# EAGLE design MCP73871_Solar (EAGLE 5.01)
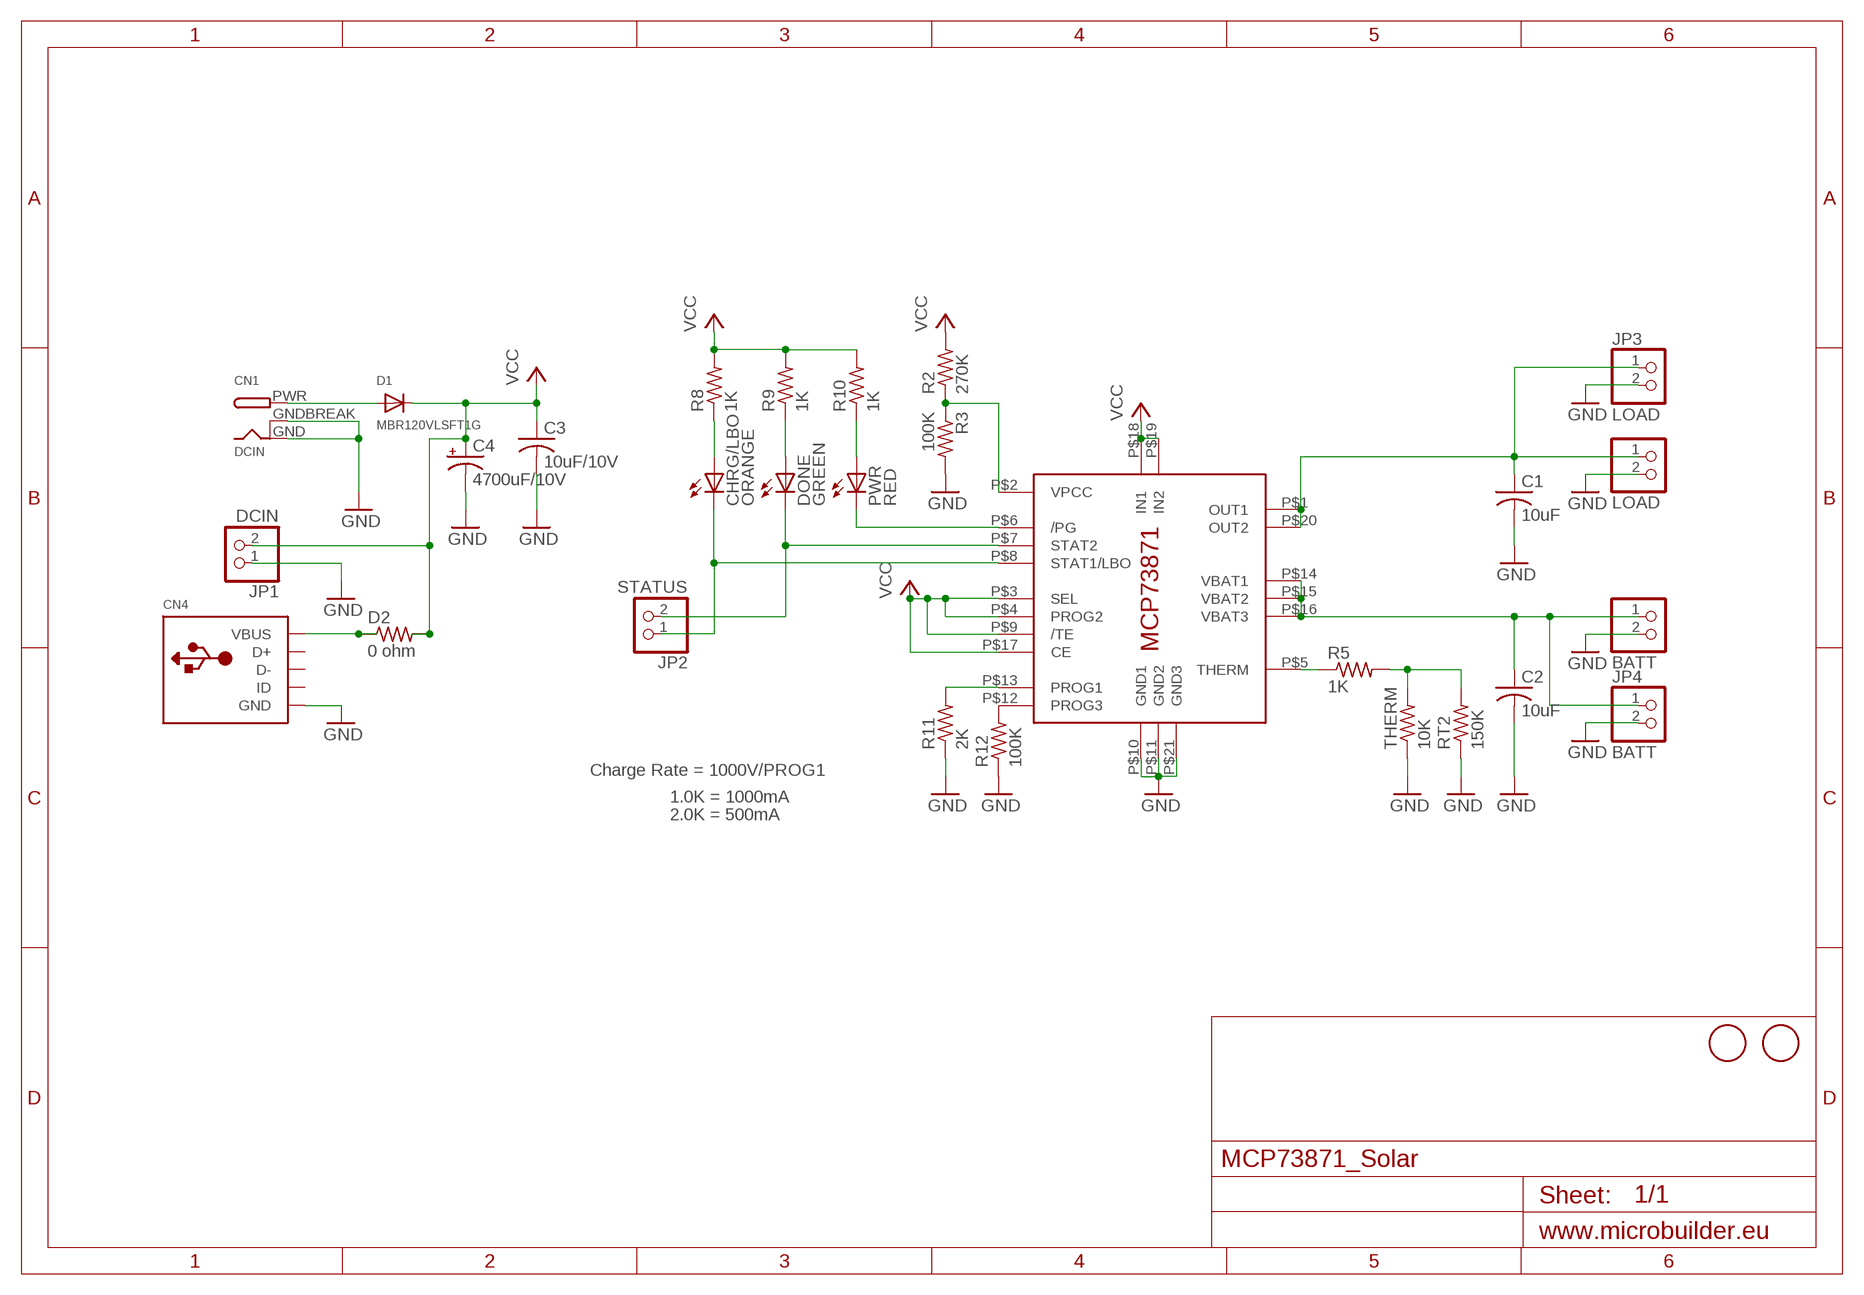
[diagram p0: schematic, sheet 1]

## Parts
BATT  JST_2PIN-SMT-RA  [JST-PH-2-SMT-RA]
C1  10uF  C-USC0805K  [C0805K]
C2  10uF  C-USC0805K  [C0805K]
C3  10uF/10V  C-USC0805K  [C0805K]
C4  4700uF/10V  CPOL-USE5-13  [E5-13]
CHRG/LBO  ORANGE  LEDCHIP-LED0805  [CHIP-LED0805]
CN1  DCIN  DCBARREL1.3MM  [DCJACK_1.3MM_PTH]
CN4  USBMINIB  [USB-MINIB]
D1  MBR120VLSFT1G  DIODESOD-123  [SOD-123]
D2  0 ohm  R-US_R0805  [R0805]
DONE  GREEN  LEDCHIP-LED0805  [CHIP-LED0805]
IC1  MCP73871  [QFN20_4MM]
JP1  DCIN  HEADER-1X2  [1X02_OVAL]
JP2  STATUS  HEADER-1X2  [1X02_OVAL]
JP3  LOAD  HEADER-1X2  [1X02_OVAL]
JP4  BATT  HEADER-1X2  [1X02_OVAL]
LOAD  JST_2PIN-SMT-RA  [JST-PH-2-SMT-RA]
PWR  RED  LEDCHIP-LED0805  [CHIP-LED0805]
R2  270K  R-US_R0805  [R0805]
R3  100K  R-US_R0805  [R0805]
R5  1K  R-US_M0805  [M0805]
R8  1K  R-US_R0805  [R0805]
R9  1K  R-US_R0805  [R0805]
R10  1K  R-US_R0805  [R0805]
R11  2K  R-US_FLIPFLOP  [0805-THM]
R12  100K  R-US_R0805  [R0805]
RT2  150K  R-US_M0805  [M0805]
THERM  10K  R-US_FLIPFLOP  [0805-THM]
U$2  FIDUCIAL  [FIDUCIAL_1MM]
U$3  FIDUCIAL  [FIDUCIAL_1MM]

## Nets
BATT: BATT.1 C2.1 IC1.P$14(VBAT1) IC1.P$15(VBAT2) IC1.P$16(VBAT3) JP4.1
GND: BATT.2 C1.2 C2.2 C3.2 C4.- CN1.GND CN1.GNDBREAK CN4.GND IC1.P$10(GND1) IC1.P$11(GND2) IC1.P$21(GND3) JP1.1 JP3.2 JP4.2 LOAD.2 R3.2 R11.1 R12.1 RT2.1 THERM.1
N$1: IC1.P$6(/PG) PWR.C
N$2: CN4.VBUS D2.1
N$4: DONE.C IC1.P$7(STAT2) JP2.2
N$5: IC1.P$5(THERM) R5.1
N$6: IC1.P$2(VPCC) R2.1 R3.1
N$7: C1.1 IC1.P$1(OUT1) IC1.P$20(OUT2) JP3.1 LOAD.1
N$8: R5.2 RT2.2 THERM.2
N$10: CN1.PWR D1.A
N$11: CHRG/LBO.C IC1.P$8(STAT1/LBO) JP2.1
N$12: CHRG/LBO.A R8.1
N$13: DONE.A R9.1
N$14: PWR.A R10.1
N$15: IC1.P$12(PROG3) R12.2
N$16: IC1.P$13(PROG1) R11.2
VCC: C3.1 C4.+ D1.C D2.2 IC1.P$3(SEL) IC1.P$4(PROG2) IC1.P$9(/TE) IC1.P$17(CE) IC1.P$18(IN1) IC1.P$19(IN2) JP1.2 R2.2 R8.2 R9.2 R10.2
Unconnected: CN4.D+ CN4.D- CN4.ID

## Notes on the sheet
- Charge Rate = 1000V/PROG1
- 1.0K = 1000mA
- 2.0K = 500mA

## Library data of the parts
BATT LOAD = adafruit:JST_2PIN: JST 2-Pin Connectors of various flavors SMT-RA (S2B-PH-SM4) 4UConnector #17311 SMT (B2B-PH-SM4) THM-RA (S2B-PH) THM (B2B-PH)
C1-C3 = adafruit:C-US: CAPACITOR, American symbol
C4 = adafruit:CPOL-US: POLARIZED CAPACITOR, American symbol
CHRG/LBO DONE PWR = adafruit:LED: LED OSRAM: - CHIPLED LG R971, LG N971, LY N971, LG Q971, LY Q971, LO R971, LY R971 LH N974, LH R974 LS Q976, LO Q976, LY Q976 LO Q996 - Hyper CHIPLED LW Q18S LB Q993, LB Q99A, LB R99A - SideLED LS A670, LO A670, LY A670, LG A670, LP A670 LB A673, LV A673, LT A673, LW A673 LH A674 LY A675 LS A676, LA A676, LO A676, LY A676, LW A676 LS A679, LY A679, LG A679 - Hyper Micro SIDELED® LS Y876, LA Y876, LO Y876, LY Y876 LT Y87S - SmartLED LW L88C, LW L88S LB L89C, LB L89S, LG L890 LS L89K, LO L89K, LY L89K LS L896, LA L896, LO L896, LY L896 - TOPLED LS T670, LO T670, LY T670, LG T670, LP T670 LSG T670, LSP T670, LSY T670, LOP T670, LYG T670 LG T671, LOG T671, LSG T671 LB T673, LV T673, LT T673, LW T673 LH T674 LS T676, LA T676, LO T676, LY T676, LB T676, LH T676, LSB T676, LW T676 LB T67C, LV T67C, LT T67C, LS T67K, LO T67K, LY T67K, LW E67C LS E67B, LA E67B, LO E67B, LY E67B, LB E67C, LV E67C, LT E67C LW T67C LS T679, LY T679, LG T679 LS T770, LO T770, LY T770, LG T770, LP T770 LB T773, LV T773, LT T773, LW T773 LH T774 LS E675, LA E675, LY E675, LS T675 LS T776, LA T776, LO T776, LY T776, LB T776 LHGB T686 LT T68C, LB T68C - Hyper Mini TOPLED® LB M676 - Mini TOPLED Santana® LG M470 LS M47K, LO M47K, LY M47K Source: http://www.osram.convergy.de/
CN1 = microbuilder:DCBARREL: DC Barrel Jack DCJACK_1.3MM_PTH - Through Hole 1.3mm Jack (4UConnector: 05536) DCJACK_2MM_PTH - Through Hole 2.0/2.1 Jack (4UConnector: 05537) DCJACK_2MM_SMT - SMT 2.0/2.1mm Jack(4UConnector: 03267)
CN4 = adafruit:USB: USB Connectors USBMINIB - Surface Mount Female Mini-B USB Connector 4UConnector: 06564 By microbuilder.eu Thru-hole RA Female Mini-B USB Connector 4UConnector: 18732 By ladyada.net
D1 = microbuilder:DIODE: Diode SMADIODE - SMA Surface Mount Package 20V 1A Schottky Diode Digikey (500mV @ 1A, 500uA Vr @ 20V): 641-1014-6-ND SOD-123 30V 500mA (430mV Vf, 130uA Vr @ 30V) Schottky Diode - Digikey: B0530W-FDICT-ND SOD-323 10V 570mA (380mV Vf, 3ns) Schottky Diode - Digikey: ZLLS410CT-ND 1N4148WS - 75V 150mA (1V Vf @ 10mA, 4ns) Simple Diode - Digikey: 1N4148WSFSCT-ND, Mouser: 512-1N4148WS SOD-523 30V 30mA Schottky Diode (RB751S-40TE61) - Digikey: RB751S-40TE61CT-ND SOT23-R/W - SOT23 Package (R = Solder Paste/Reflow Ovens, W = Hand-Soldering) BAT54Film 40V 300mA - Digikey: 497-7162-1-ND DO-1N4148 Through Hole Small Current Diode (any model)
D2 R2 R3 R5 R8-R12 RT2 THERM = adafruit:R-US_: RESISTOR, American symbol
IC1 = adafruit:MCP73871
JP1-JP4 = microbuilder:HEADER-1X2: PIN HEADER
U$2 U$3 = adafruit:FIDUCIAL: For use by pick and place machines to calibrate the vision/machine, 1mm By microbuilder.eu

## Board
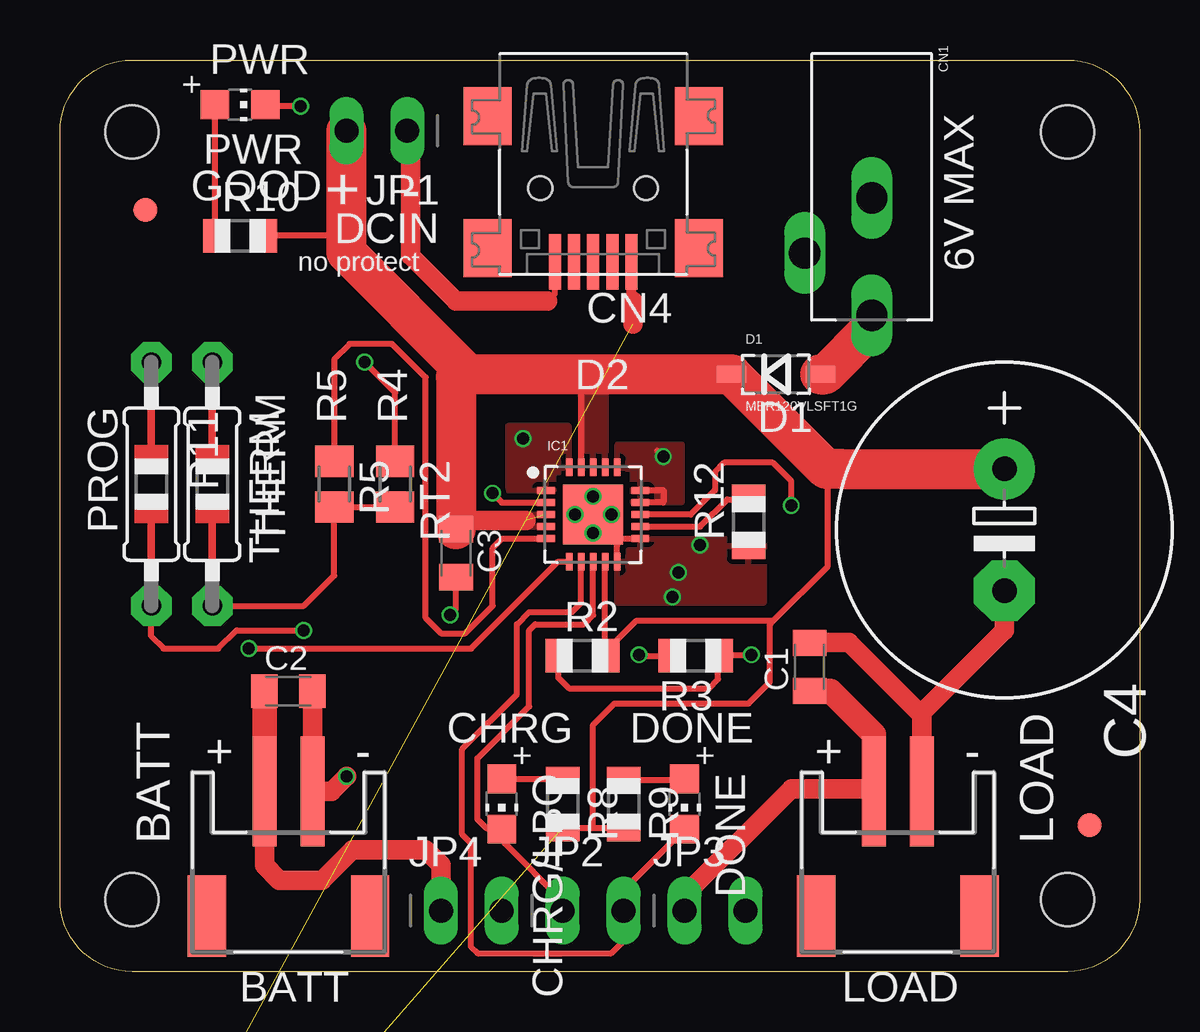
[diagram p1: board, top side]
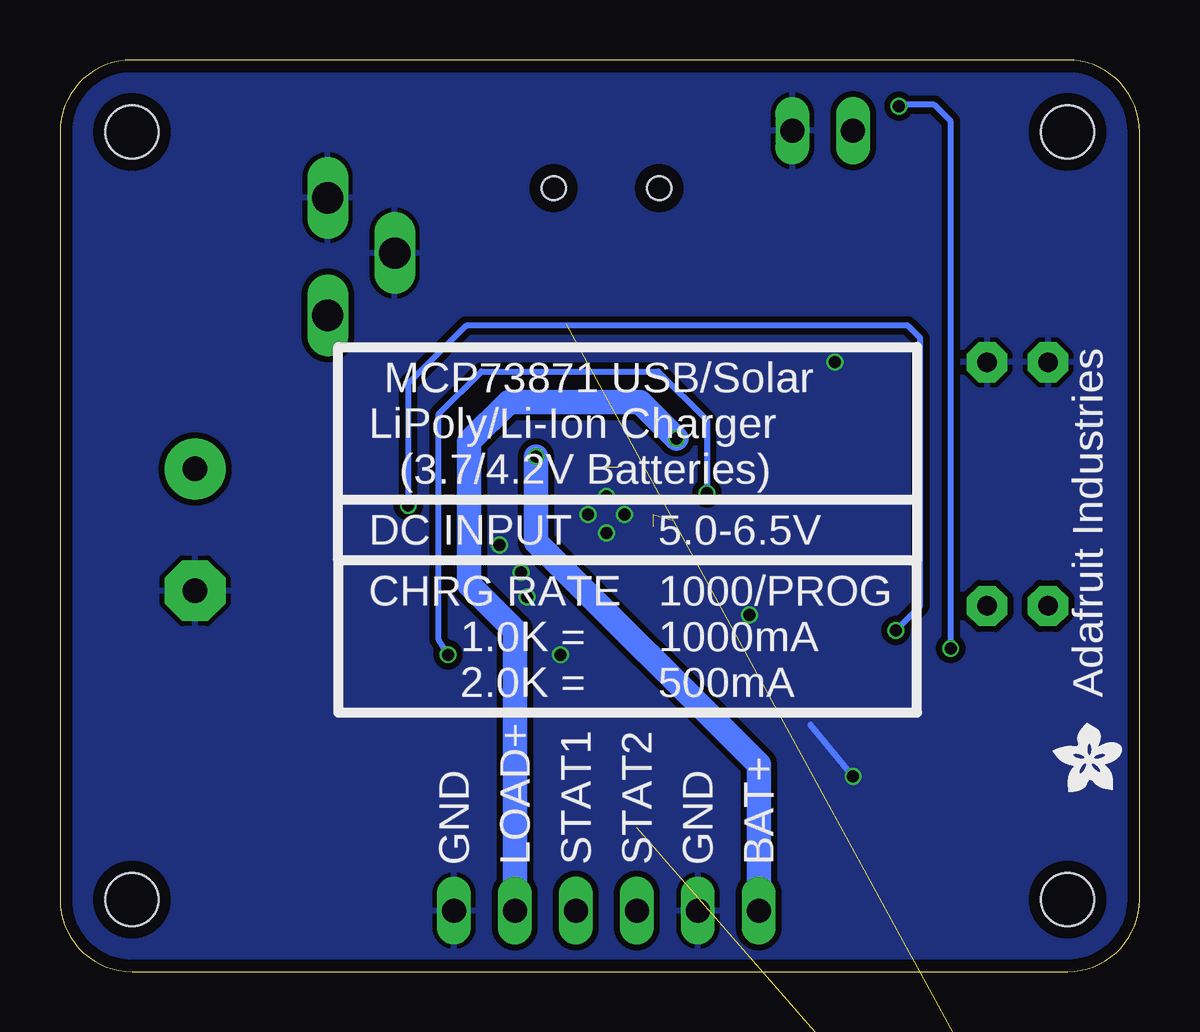
[diagram p2: board, bottom side, seen from below]

Size 45 x 38 mm. Coordinates in mm from the lower left corner, seen from the top.
Outline: 0,3 0,35 arc-90 3,38 42,38 arc-90 45,35 45,3 arc-90 42,0 3,0 arc-90 0,3
Copper layers (1*16): Top 0.035mm / dielectric 1.5mm / Bottom 0.035mm
Design rules "PCBCart-.1mmAnnulars": minimum track width 8mil, minimum drill 0.4mm, track to track 8mil, track to pad 8mil, pad to pad 8mil, via to via 8mil, smd to smd 8mil, copper to edge 20mil, drill to drill 8mil, minimum pad ring 8mil, minimum via ring 4mil, stop-mask expansion 3mil, vias tented up to drill 20mil, thermal gap 8mil
Holes 2.2 mm at 3,35 3,3 42,3 42,35
tRestrict: area 20.1,18.7 to 20.4,18.9; 9 lines

### Footprints (pad centres in the part's own frame; a part is rotated, then mirrored left to right if it is on the bottom)
JST-PH-2-SMT-RA = smd 1 x 4.6: 1 1,-3.7; 2 -1,-3.7 | smd 1.6 x 3.4: NC1 -3.4,1.5; NC2 3.4,1.5
C0805K = smd 1.1 x 1.4: 1 -1,0; 2 1,0
E5-13 = drill 1.016 pad 2.54 round: + -2.54,0 | drill 1.016 pad 2.54 octagon: - 2.54,0
CHIP-LED0805 = smd 1.2 x 1.2: A 0,-1.05; C 0,1.05
DCJACK_1.3MM_PTH = drill 1.3 long: GND 0,6; GNDBREAK 2.8,8.3; PWR 0,10.9
USB-MINIB = smd 0.5 x 2.308: D+ 0,4.064; D- -0.8,4.064; GND 1.6,4.064; ID 0.8,4.064; VBUS -1.6,4.064 | smd 2 x 2.4: GND1 -4.4,-2; GND2 -4.4,3.5; GND3 4.4,3.5; GND4 4.4,-2 | hole 1: -2.2,1; 2.2,1
SOD-123 = smd 1.2 x 0.7: A 1.85,0; C -1.85,0
R0805 = smd 1.1 x 1.4: 1 -1,0; 2 1,0
QFN20_4MM = smd 0.73 x 0.28: P$1 -1.965,1; P$2 -1.965,0.5; P$3 -1.965,0; P$4 -1.965,-0.5; P$5 -1.965,-1; P$11 1.965,-1; P$12 1.965,-0.5; P$13 1.965,0; P$14 1.965,0.5; P$15 1.965,1 | smd 0.28 x 0.73: P$6 -1,-1.965; P$7 -0.5,-1.965; P$8 0,-1.965; P$9 0.5,-1.965; P$10 1,-1.965; P$16 1,1.965; P$17 0.5,1.965; P$18 0,1.965; P$19 -0.5,1.965; P$20 -1,1.965 | smd 2.5 x 2.5: P$21 0,0
1X02_OVAL = drill 1 long: 1 -1.27,0; 2 1.27,0
M0805 = smd 1.3 x 1.6: 1 -0.95,0; 2 0.95,0
0805-THM = drill 0.813 pad 1.676 octagon: 1 -5.08,0; 2 5.08,0
FIDUCIAL_1MM = smd 1 x 1: 1 0,0

### Placement (x,y rotation side)
BATT  9.53,3.81 180 top
C1  31.24,12.7 90 top
C2  9.53,11.68 0 top
C3  16.51,17.43 270 top
C4  39.37,18.41 270 top
CHRG/LBO  18.41,6.99 180 top
CN1  33.84,38.25 180 top
CN4  22.23,33.66 180 top
D1  29.84,24.89 0 top
D2  2.54,-13.97 0 top  (outside the outline)
DONE  26.04,6.99 180 top
IC1  22.23,19.05 0 top
JP1  13.21,35.05 180 top
JP2  22.23,2.54 0 top
JP3  27.3,2.54 0 top
JP4  17.14,2.54 0 top
LOAD  34.92,3.81 180 top
PWR  7.51,36.13 270 top
R2  21.78,13.16 0 top
R3  26.5,13.16 180 top
R5  11.43,20.32 270 top
R8  20.95,6.99 270 top
R9  23.5,6.99 270 top
R10  7.51,30.67 0 top
R11  3.81,20.32 270 top
R12  28.7,18.75 90 top
RT2  13.97,20.32 270 top
THERM  6.35,20.32 270 top
U$1  [ADAFRUIT200MIL]  2.29,8.89 0 bottom
U$2  3.56,31.75 0 top
U$3  42.93,6.1 0 top

### Tracks (layer width: path | path; a pad name or v marks a point on that pad's centre or on a via)
BATT  (via drill 0.5)
  Top 0.254: v25.15,21.46 24.89,21.72 | IC1.P$14 25.14,19.55 25.15,19.56 25.15,20.07 24.21,20.07 IC1.P$15
  Top 0.813: BATT.1 8.53,4.43 9.14,3.81 10.92,3.81 12.19,5.08 15.24,5.08 15.88,4.45 JP4.1
  Top 1.016: BATT.1 C2.1
  Bottom 1.016: JP4.1 15.88,8.64 25.15,17.91 v25.15,21.46
  pour Top: 23.24,20.95 23.24,21.97 25.91,21.97 25.91,19.56 23.88,19.56 23.88,20.95
GND  (via drill 0.5)
  Top 0.254: v22.23,19.81 23.23,18.05 IC1.P$11 | IC1.P$10 23.23,18.02 23.24,18.03 | R3.2 24.18,13.16 v24.13,13.21 | C3.2 16.51,15.11 v16.26,14.86 | RT2.1 13.97,24.13 v12.7,25.4 | CN4.GND 20.62,28.25 20.32,27.94
  Top 0.406: 31.26,13.72 C1.2 | IC1.P$21 v22.99,19.05
  Top 0.813: LOAD.2 35.92,10.68 | 35.92,10.68 32.89,13.72 31.26,13.72 | v11.94,8.13 11.32,7.51 BATT.2 C2.2 | 20.32,27.94 16.51,27.94 14.61,29.84 14.61,34.92 JP1.1 | 35.92,10.68 35.92,10.78 39.37,14.22 C4.-
  Bottom 0.254: v11.94,8.13 13.72,10.29 | v16.26,14.86 16,14.86
  other vias: 25.53,15.62 25.78,16.64 26.67,17.78 22.23,18.29 21.46,19.05
  pour Bottom (isolate 0.254): 0,0 0,38 45,38 45,0
  pour Top: 23.24,18.03 29.34,18.03 29.34,15.37 23.24,15.37
N$1  (via drill 0.5)
  Top 0.254: IC1.P$6 20.77,17.09 17.14,13.46 v7.87,13.46 | v10.03,36.07 8.62,36.07 PWR.C
  Bottom 0.254: v7.87,13.46 7.87,35.45 PWR.C 9.97,36.13 v10.03,36.07
N$2  (1 unrouted)
  Top 0.406: CN4.VBUS 23.82,28.25 23.88,27.94
  Top 0.813: 23.88,27 23.88,27.94
N$4
  Top 0.254: DONE.C 23.5,3.4 JP2.2 23.5,1.27 22.99,0.76 17.4,0.76 17.14,1.02 17.14,5.33 16.76,5.71 16.76,9.27 19.05,11.56 19.05,14.48 19.56,14.99 21.34,14.99 21.73,15.38 IC1.P$7
N$5
  Top 0.254: IC1.P$5 18.43,18.05 18.03,17.65 18.03,15.24 16.89,14.1 15.88,14.1 15.24,14.73 15.24,24.77 13.84,26.16 12.06,26.16 11.43,25.53 R5.1
N$6  (via drill 0.5)
  Top 0.254: IC1.P$2 18.42,19.55 v18.03,19.94 | R2.1 20.78,12.24 21.21,11.81 27.05,11.81 27.43,12.19 27.43,13.1 R3.1 27.54,13.21 v28.83,13.21
  Bottom 0.254: v18.03,19.94 18.03,22.99 20.07,25.02 27.43,25.02 29.21,23.24 29.21,13.84 v28.83,13.21
N$7  (via drill 0.5)
  Top 0.813: LOAD.1 33.81,7.62 30.48,7.62 26.04,3.17 JP3.1
  Top 1.016: LOAD.1 33.92,9.89 32.12,11.7 C1.1
  Bottom 1.016: JP3.1 26.04,14.22 27.94,16.13 27.94,22.1 26.29,23.75 20.83,23.75 v19.3,22.23
  pour Top: 21.21,20.83 21.21,22.61 21.21,22.73 18.67,22.73 18.67,20.07 20.45,20.07 20.57,20.07 20.57,20.7 20.57,20.83
N$8
  Top 0.254: RT2.2 R5.2 11.43,16.51 10.16,15.24 THERM.2
N$10
  Top 1.676: CN1.PWR 33.84,26.86 31.88,24.89 D1.A
N$11
  Top 0.254: IC1.P$8 22.23,14.86 21.84,14.48 19.81,14.48 19.56,14.22 19.56,11.05 17.4,8.89 17.4,6.35 17.78,5.97 18.38,5.97 CHRG/LBO.C | CHRG/LBO.C 18.51,5.84 | JP2.1 20.95,2.92 18.54,5.33 18.54,5.81 CHRG/LBO.C
N$12
  Top 0.254: CHRG/LBO.A 20.91,8.04 R8.1
N$13
  Top 0.254: R9.1 25.98,7.99 DONE.A
N$14
  Top 0.254: PWR.A 6.46,30.72 R10.1
N$15
  Top 0.254: IC1.P$12 26.68,18.55 27.81,19.68 28.64,19.68 R12.2
N$16  (via drill 0.5)
  Top 0.254: IC1.P$13 26.29,19.05 27.3,20.07 27.3,20.83 27.69,21.21 29.72,21.21 30.48,20.45 v30.48,19.43 | v10.16,14.22 7.37,14.22 6.6,13.46 4.32,13.46 3.81,13.97 R11.2
  Bottom 0.254: v30.48,19.43 30.48,24.51 28.07,26.92 9.65,26.92 9.14,26.42 9.14,15.24 v10.16,14.22
VCC  (5 unrouted)
  Top 0.254: IC1.P$9 22.73,13.21 R2.2 22.78,13.38 24,14.61 29.72,14.61 | R10.2 11.62,30.67 11.94,30.35 | R8.2 22.23,5.99 | 22.23,5.99 R9.2 | 22.23,5.99 22.23,10.29 23.11,11.18 28.7,11.18 29.59,12.06 29.59,14.48 29.72,14.61 | 29.72,14.61 32,16.89 32,20.88 32.57,20.95 | IC1.P$19 21.73,25.39 21.59,24.89
  Top 0.813: C3.1 16.78,18.43 17.14,18.8 19.43,18.8
  Top 1.27: 20.32,24.89 20.38,24.95 | 20.57,24.89 20.5,24.96
  Top 1.676: JP1.2 11.94,30.35 11.94,29.97 16.83,25.08 | 16.83,25.08 17.02,24.89 20.32,24.89 20.57,24.89 21.59,24.89 D1.C 31.93,20.95 32.57,20.95 C4.+ | C3.1 16.51,24.77 16.83,25.08
  pour Top: 21.72,20.89 21.72,25.53 22.73,25.53 22.73,20.89
  pour Top: 20.32,19.05 17.65,19.05 17.65,18.54 20.32,18.54

### Text on the board
tPlace: PWR | GOOD | + | - | DCIN | no protect | 6V MAX | D2 | R5 | R4 | D1 | PROG | THERM | CHRG | DONE | BATT | LOAD
bPlace: MCP73871 USB/Solar | LiPoly/Li-Ion Charger | (3.7/4.2V Batteries) | 5.0-6.5V | DC INPUT | 1000/PROG | CHRG RATE | 1000mA | 1.0K = | Adafruit Industries | 500mA | 2.0K = | BAT+ | GND | STAT2 | STAT1 | LOAD+ | GND